# Altium schematic sheet Connector.SchDoc
size A4; Author: Andreas Geiger; CompanyName: Technische Hochschule Nürnberg Georg Simon Ohm; Address1: Wassertorstr. 10; Address2: 90489 Nürnberg; Address3: GERMANY; DocumentNumber: 1; SheetNumber: 1; SheetTotal: 1; CompanyName2: TH Nürnberg
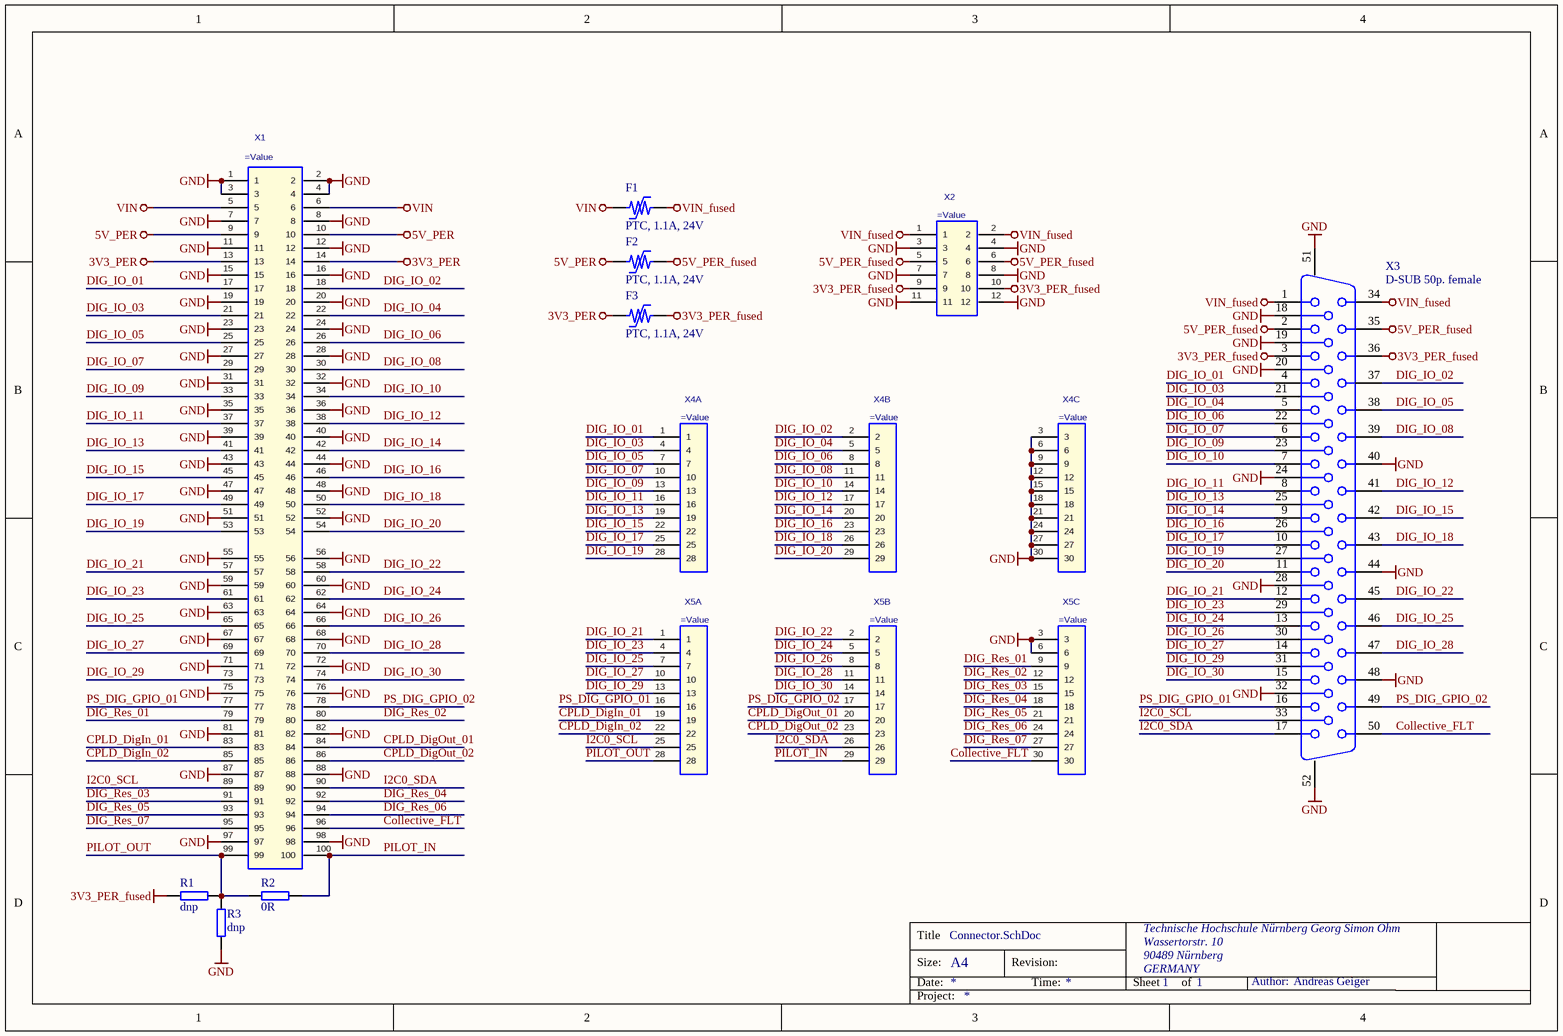
[diagram p0: Connector.SchDoc]

## Parts
F1  PTC, 1.1A, 24V  [1812_PTC_Polyfuse_Littelfuse]
F2  PTC, 1.1A, 24V  [1812_PTC_Polyfuse_Littelfuse]
F3  PTC, 1.1A, 24V  [1812_PTC_Polyfuse_Littelfuse]
R1  dnp  [R_0603_N]
R2  0R  [R_0603_N]
R3  dnp  [R_0603_N]
X1  (no value)  [HSEC8-150-01-XX-DV-A-BL-CARD]  (no BOM)
X2  (no value)  [TSW-106-XX-XXX-D]
X3  D-SUB 50p. female  [164A18759X]
X4  (no value)  [TSW-110-XX-XXX-T]  (parts A,B,C of 3)
X5  (no value)  [TSW-110-XX-XXX-T]  (parts A,B,C of 3)

## Nets
3V3_PER: F3.1 X1.13 X1.14
3V3_PER_fused: F3.2 R1.1 X2.9 X2.10 X3.3 X3.36
5V_PER: F2.1 X1.9 X1.10
5V_PER_fused: F2.2 X2.5 X2.6 X3.2 X3.35
GND: R3.1 X1.1 X1.2 X1.3 X1.4 X1.7 X1.8 X1.11 X1.12 X1.15 X1.16 X1.19 X1.20 X1.23 X1.24 X1.27 X1.28 X1.31 X1.32 X1.35 X1.36 X1.39 X1.40 X1.43 X1.44 X1.47 X1.48 X1.51 X1.52 X1.55 X1.56 X1.59 X1.60 X1.63 X1.64 X1.67 X1.68 X1.71 X1.72 X1.75 X1.76 X1.81 X1.82 X1.87 X1.88 X1.97 X1.98 X2.3 X2.4 X2.7 X2.8 X2.11 X2.12 X3.18 X3.19 X3.20 X3.24 X3.28 X3.32 X3.40 X3.44 X3.48 X3.51 X3.52 X4.3 X4.6 X4.9 X4.12 X4.15 X4.18 X4.21 X4.24 X4.27 X4.30 X5.3 X5.6
VIN: F1.1 X1.5 X1.6
VIN_fused: F1.2 X2.1 X2.2 X3.1 X3.34
Collective_FLT: X1.96 X3.50 X5.30
CPLD_DigIn_01: X1.83 X5.19
CPLD_DigIn_02: X1.85 X5.22
CPLD_DigOut_01: X1.84 X5.20
CPLD_DigOut_02: X1.86 X5.23
DIG_IO_01: X1.17 X3.4 X4.1
DIG_IO_02: X1.18 X3.37 X4.2
DIG_IO_03: X1.21 X3.21 X4.4
DIG_IO_04: X1.22 X3.5 X4.5
DIG_IO_05: X1.25 X3.38 X4.7
DIG_IO_06: X1.26 X3.22 X4.8
DIG_IO_07: X1.29 X3.6 X4.10
DIG_IO_08: X1.30 X3.39 X4.11
DIG_IO_09: X1.33 X3.23 X4.13
DIG_IO_10: X1.34 X3.7 X4.14
DIG_IO_11: X1.37 X3.8 X4.16
DIG_IO_12: X1.38 X3.41 X4.17
DIG_IO_13: X1.41 X3.25 X4.19
DIG_IO_14: X1.42 X3.9 X4.20
DIG_IO_15: X1.45 X3.42 X4.22
DIG_IO_16: X1.46 X3.26 X4.23
DIG_IO_17: X1.49 X3.10 X4.25
DIG_IO_18: X1.50 X3.43 X4.26
DIG_IO_19: X1.53 X3.27 X4.28
DIG_IO_20: X1.54 X3.11 X4.29
DIG_IO_21: X1.57 X3.12 X5.1
DIG_IO_22: X1.58 X3.45 X5.2
DIG_IO_23: X1.61 X3.29 X5.4
DIG_IO_24: X1.62 X3.13 X5.5
DIG_IO_25: X1.65 X3.46 X5.7
DIG_IO_26: X1.66 X3.30 X5.8
DIG_IO_27: X1.69 X3.14 X5.10
DIG_IO_28: X1.70 X3.47 X5.11
DIG_IO_29: X1.73 X3.31 X5.13
DIG_IO_30: X1.74 X3.15 X5.14
DIG_Res_01: X1.79 X5.9
DIG_Res_02: X1.80 X5.12
DIG_Res_03: X1.91 X5.15
DIG_Res_04: X1.92 X5.18
DIG_Res_05: X1.93 X5.21
DIG_Res_06: X1.94 X5.24
DIG_Res_07: X1.95 X5.27
I2C0_SCL: X1.89 X3.33 X5.25
I2C0_SDA: X1.90 X3.17 X5.26
PILOT_IN: R2.2 X1.100 X5.29
PILOT_OUT: R1.2 R2.1 R3.2 X1.99 X5.28
PS_DIG_GPIO_01: X1.77 X3.16 X5.16
PS_DIG_GPIO_02: X1.78 X3.49 X5.17

## Notes on the sheet
- Title
- Size:
- Date:
- A4
- Revision:
- Time:
- Sheet
- of
- Author:
- Project:

## Library data of the parts
F1-F3 = Littelfuse_PTC_1812: Resettable PTC Polyfuse SMD, 1812, automotive; MPN: miniASMDC110F/24; Trip Current: 2.2A; Resistance: 0.18Ohm; MF: Littelfuse; Created: 2019_02_10_AGeiger; Package: 1812; ComponentLink1URL: https://www.littelfuse.com/~/media/electronics/datasheets/resettable_ptcs/littelfuse_ptc_surface_mount_catalog_datasheet.pdf.pdf; ComponentLink1Description: Datasheet; Value: PTC, 1.1A, 24V; Voltage: 24V; Hold Current: 1.1A
R1 = R_0603: SMD Resistor 0603; MPN: MCWR06X1002FTL; Value: 10k; Tolerance: 1%; Voltage: 50V; Power: 100mW; Assembly: dnp; MF: Multicomp; Package: 0603; Created: 2018_09_06_AGeiger; Supplier 1: Farnell; Supplier Part Number 1: 2447230
R2 = R_0603: SMD Resistor 0603; MPN: MCMR06X000 PTL; Tolerance: 1%; Voltage: 75V; Power: 100mW; MF: Multicomp; Package: 0603; Value: 0R; Created: 2018_09_06_AGeiger; Supplier 1: Farnell; Supplier Part Number 1: 2073345
R3 = R_0603: SMD Resistor 0603; Value: tbd; Tolerance: 1%; Assembly: dnp; Package: 0603; Created: 2018_09_06_AGeiger; Voltage: tbd; Power: tbd; Supplier 1: *; Supplier Part Number 1: *
X1 = HSEC8-150-01-XX-DV-A-BL-CARD: Mating Card Layout for HSEC8-150-01-XX-DV-A-BL; MF: SAMTEC; Created: 2018_04_23_AGeiger; MPN: HSEC8-150-01-XX-DV-A-BL-CARD; Value: HSEC8-150-01-XX-DV-A-BL-CARD
X2 = TSW-106-XX-XXX-D: Pin Header, 2.54mm; MPN: TSW-106-07-F-D; MF: SAMTEC; Value: TSW-106-07-F-D; Created: 2019_02_10_AGeiger
X3 = 164A18759X: D-SUB, female, right angle, 50pos, 9.4mm pitch; MF: CONEC; MPN: 164A18759X; Value: D-SUB 50p. female; Supplier Part Number 1: D-SUB BU 50GWC; Supplier 1: Reichelt
X4 X5 = TSW-110-XX-XXX-T: Pin Header, 2.54mm; MPN: TSW-110-07-F-T; MF: SAMTEC; Value: TSW-110-07-F-T; Created: 2019_02_10_AGeiger